# EasyEDA schematic Planter monitor Schematic PCB_V1.0.0_2023-12-30 EasyEDA.json
TITLE: Planter Monitor; REV: 1.0.0; Date: 2023-12-30; Sheet: 1/1; Drawn By: Alexthecoolman; Company: No Company
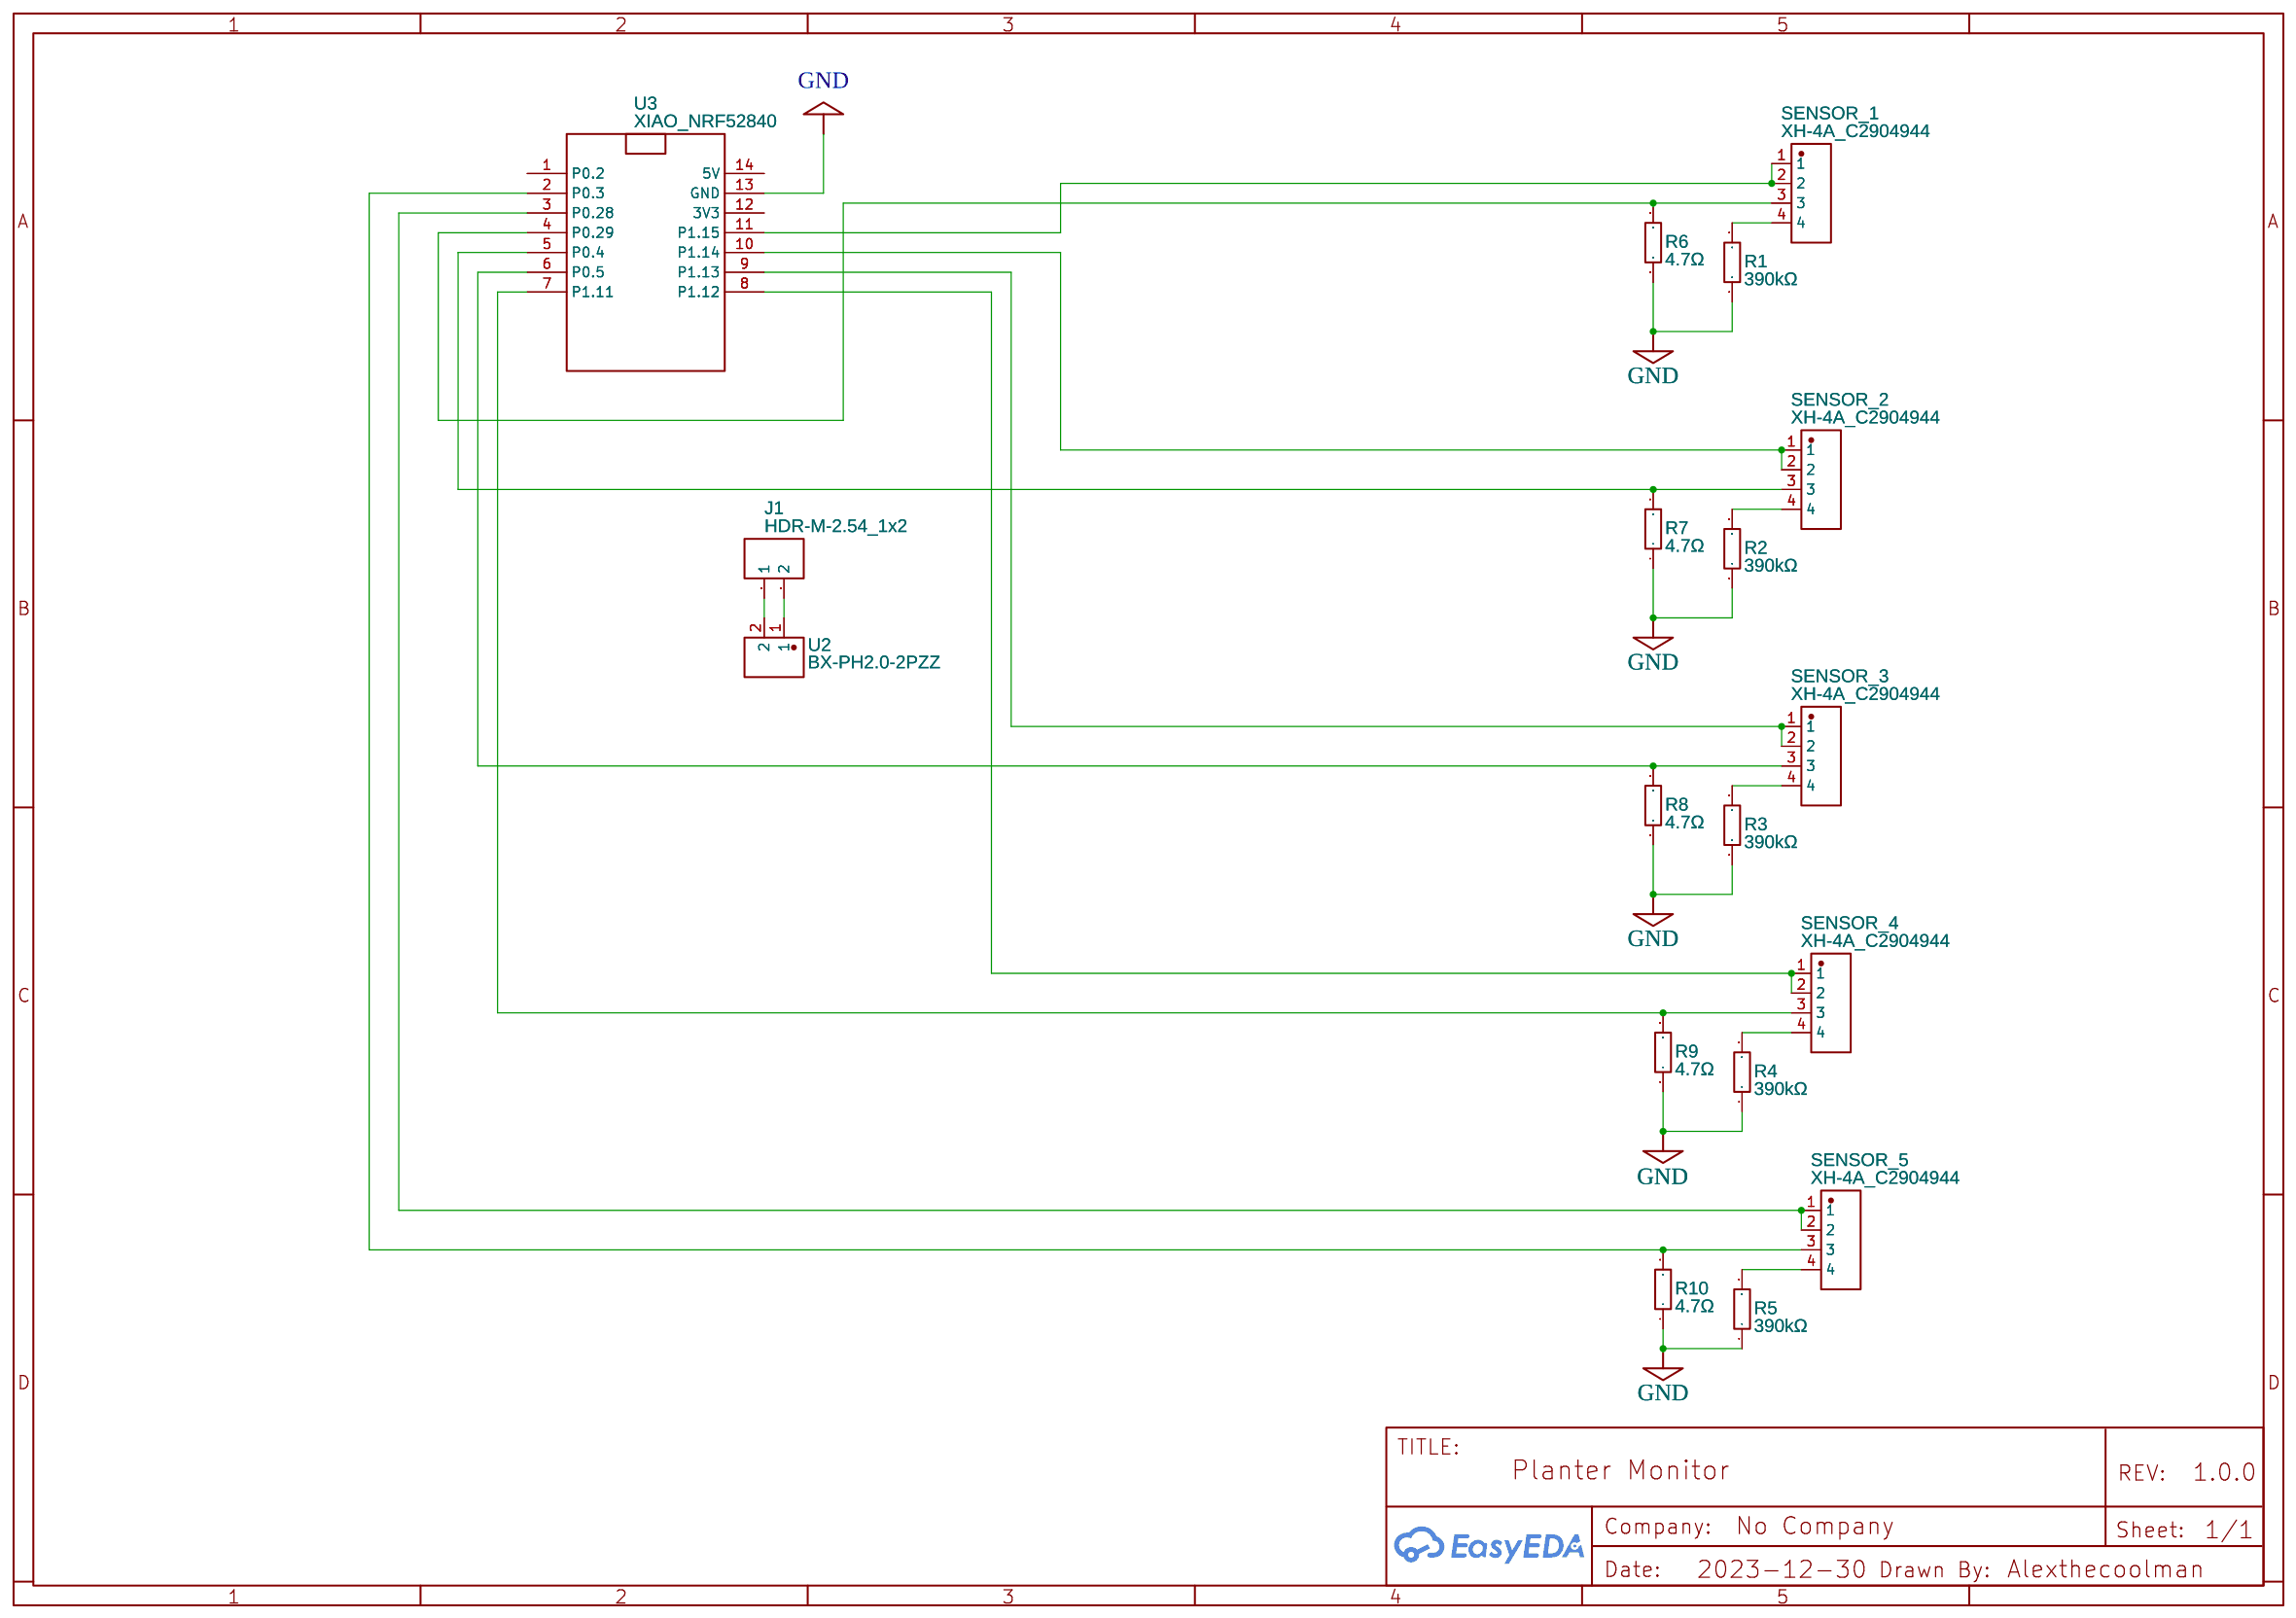
[diagram p0: schematic sheet]

## Parts
J1  HDR-M-2.54_1x2  [HDR-M-2.54_1X2]
R1  390kΩ  [RES-TH_BD2.3-L6.5-P10.50-D0.5]
R2  390kΩ  [RES-TH_BD2.3-L6.5-P10.50-D0.5]
R3  390kΩ  [RES-TH_BD2.3-L6.5-P10.50-D0.5]
R4  390kΩ  [RES-TH_BD2.3-L6.5-P10.50-D0.5]
R5  390kΩ  [RES-TH_BD2.3-L6.5-P10.50-D0.5]
R6  4.7Ω  [RES-TH_BD2.2-L6.5-P10.50-D0.6]
R7  4.7Ω  [RES-TH_BD2.2-L6.5-P10.50-D0.6]
R8  4.7Ω  [RES-TH_BD2.2-L6.5-P10.50-D0.6]
R9  4.7Ω  [RES-TH_BD2.2-L6.5-P10.50-D0.6]
R10  4.7Ω  [RES-TH_BD2.2-L6.5-P10.50-D0.6]
SENSOR_1  XH-4A_C2904944  [CONN-TH_4P-P2.50-XH2.54-4P]
SENSOR_2  XH-4A_C2904944  [CONN-TH_4P-P2.50-XH2.54-4P]
SENSOR_3  XH-4A_C2904944  [CONN-TH_4P-P2.50-XH2.54-4P]
SENSOR_4  XH-4A_C2904944  [CONN-TH_4P-P2.50-XH2.54-4P]
SENSOR_5  XH-4A_C2904944  [CONN-TH_4P-P2.50-XH2.54-4P]
U2  BX-PH2.0-2PZZ  [CONN-TH_2P-P2.00_BOSSIE_BX-PH2.0-2PZZ]
U3  XIAO_NRF52840  [XIAO-NRF52840 [ARCTURUS]]

## Library data of the parts
J1 = HDR-M-2.54_1x2: Supplier Part: C124375; Supplier: LCSC; Contributor: LCEDA_Lib
R1-R5 = MF1/4W-390KΩ±1% T52: Contributor: LCSC; Supplier: LCSC; Supplier Part: C119379; Manufacturer: CCO(千志电子); Manufacturer Part: MF1/4W-390KΩ±1% T; JLCPCB Part Class: Extended Part
R6-R10 = MF1/4W-4.7Ω±1% T52: Contributor: LCSC; Supplier: LCSC; Supplier Part: C119276; Manufacturer: CCO(千志电子); Manufacturer Part: MF1/4W-4.7Ω±1% T; JLCPCB Part Class: Extended Part
SENSOR_1-SENSOR_5 = XH-4A_C2904944: Contributor: LCSC; Supplier: LCSC; Supplier Part: C2904944; Manufacturer: DEALON(德艺隆); Manufacturer Part: XH-4A; JLCPCB Part Class: Extended Part
U2 = BX-PH2.0-2PZZ: Supplier: LCSC; Supplier Part: C18077744; Manufacturer: Bossie(博锡); Contributor: lcsc; JLCPCB Part Class: Extended Part
U3 = XIAO_NRF52840 [ARCTURUS]: Contributor: Kushal Soni

## Nets
GND: R1.1 R2.1 R3.1 R4.1 R5.1 R6.1 R7.1 R8.1 R9.1 R10.1 U3.13(GND)
Net-(J1-1): J1.1 U2.2
Net-(J1-2): J1.2 U2.1
Net-(R1-2): R1.2 SENSOR_1.4
Net-(R2-2): R2.2 SENSOR_2.4
Net-(R3-2): R3.2 SENSOR_3.4
Net-(R4-2): R4.2 SENSOR_4.4
Net-(R5-2): R5.2 SENSOR_5.4
Net-(R6-2): R6.2 SENSOR_1.3 U3.4(P0.29)
Net-(R7-2): R7.2 SENSOR_2.3 U3.5(P0.4)
Net-(R8-2): R8.2 SENSOR_3.3 U3.6(P0.5)
Net-(R9-2): R9.2 SENSOR_4.3 U3.7(P1.11)
Net-(R10-2): R10.2 SENSOR_5.3 U3.2(P0.3)
Net-(SENSOR_1-1): SENSOR_1.1 SENSOR_1.2 U3.11(P1.15)
Net-(SENSOR_2-1): SENSOR_2.1 SENSOR_2.2 U3.10(P1.14)
Net-(SENSOR_3-1): SENSOR_3.1 SENSOR_3.2 U3.9(P1.13)
Net-(SENSOR_4-1): SENSOR_4.1 SENSOR_4.2 U3.8(P1.12)
Net-(SENSOR_5-1): SENSOR_5.1 SENSOR_5.2 U3.3(P0.28)

Not connected (* = marked no-connect by the designer): U3 1(P0.2) 12(3V3) 14(5V)
